# EAGLE schematic RFID_bmd200 (EAGLE 7.5.0)

## Sheet 1 of 2
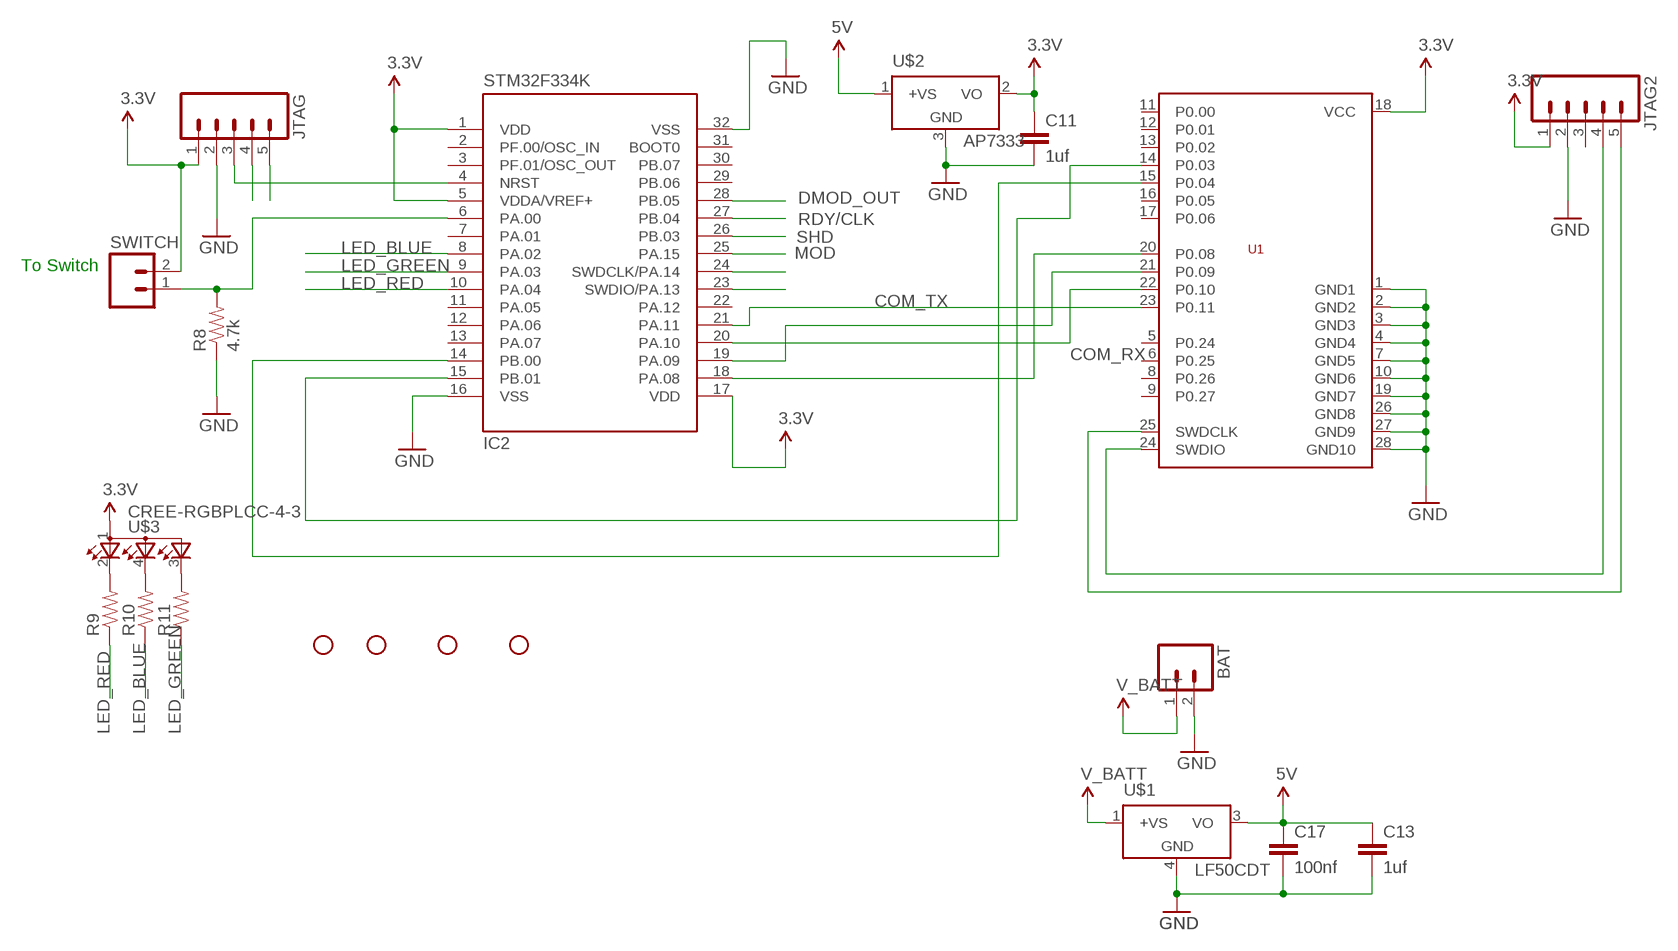
[diagram p0: schematic, sheet 1]

### Parts
BAT  M02PTH  [1X02]
C11  1uf  CAP0805  [0805]
C13  1uf  CAP0805  [0805]
C17  100nf  CAP0805  [0805]
IC2  STM32F334K  [LQFP-32]
JTAG  M05PTH  [1X05]
JTAG2  M05PTH  [1X05]
R8  4.7k  RESISTOR0805-RES  [0805]
R9  RESISTOR0805-RES  [0805]
R10  RESISTOR0805-RES  [0805]
R11  RESISTOR0805-RES  [0805]
STANDOFF1  STAND-OFF  [STAND-OFF]
STANDOFF2  STAND-OFF  [STAND-OFF]
STANDOFF3  STAND-OFF  [STAND-OFF]
STANDOFF4  STAND-OFF  [STAND-OFF]
SWITCH  M02PTH  [1X02]
U1  BMD-200  [BMD-200]
U$1  LF50CDT  [DPACK_3]
U$2  AP7333  [SOT23-3]
U$3  CREE-RGBPLCC-4-3  [P-LCC-4-3]

### Nets
3.3V: C11.1 IC2.1(VDD) IC2.5(VDDA/VREF+) IC2.17(VDD) JTAG2.1 JTAG.1 SWITCH.2 U1.18(VCC) U$2.2(VO) U$3.1(A2)
5V: C13.1 C17.1 U$1.3(VO) U$2.1(+VS) ; also sheet 2
COM_RX: IC2.20(PA.10) U1.22(P0.10)
COM_TX: IC2.19(PA.09) U1.21(P0.09)
DMOD_OUT: IC2.28(PB.05) ; also sheet 2
GND: BAT.2 C11.2 C13.2 C17.2 IC2.16(VSS) IC2.32(VSS) JTAG2.2 JTAG.2 R8.1 U1.1(GND1) U1.2(GND2) U1.3(GND3) U1.4(GND4) U1.7(GND5) U1.10(GND6) U1.19(GND7) U1.26(GND8) U1.27(GND9) U1.28(GND10) U$1.4(GND) U$2.3(GND) ; also sheet 2
LED_BLUE: IC2.8(PA.02) R10.1
LED_GREEN: IC2.9(PA.03) R11.1
LED_RED: IC2.10(PA.04) R9.1
MOD: IC2.25(PA.15) ; also sheet 2
N$3: IC2.6(PA.00) R8.2 SWITCH.1
N$4: IC2.18(PA.08) U1.20(P0.08)
N$8: IC2.21(PA.11) U1.23(P0.11)
N$16: IC2.15(PB.01) U1.14(P0.03)
N$17: JTAG2.5 U1.25(SWDCLK)
N$18: JTAG2.4 U1.24(SWDIO)
N$19: IC2.14(PB.00) U1.15(P0.04)
N$21: R9.2 U$3.2(CRED)
N$22: R10.2 U$3.4(CBLUE)
N$23: IC2.4(NRST) JTAG.3
N$26: R11.2 U$3.3(CGREEN)
RDY/CLK: IC2.27(PB.04) ; also sheet 2
SHD: IC2.26(PB.03) ; also sheet 2
STM_SWDCLK: IC2.24(SWDCLK/PA.14) JTAG.5
STM_SWDIO: IC2.23(SWDIO/PA.13) JTAG.4
V_BATT: BAT.1 U$1.1(+VS)
Unconnected: IC2.2(PF.00/OSC_IN) IC2.3(PF.01/OSC_OUT) IC2.7(PA.01) IC2.11(PA.05) IC2.12(PA.06) IC2.13(PA.07) IC2.22(PA.12) IC2.29(PB.06) IC2.30(PB.07) IC2.31(BOOT0) JTAG2.3 U1.5(P0.24) U1.6(P0.25) U1.8(P0.26) U1.9(P0.27) U1.11(P0.00) U1.12(P0.01) U1.13(P0.02) U1.16(P0.05) U1.17(P0.06)

### Notes on the sheet
- To Switch

## Sheet 2 of 2: RFid chip module
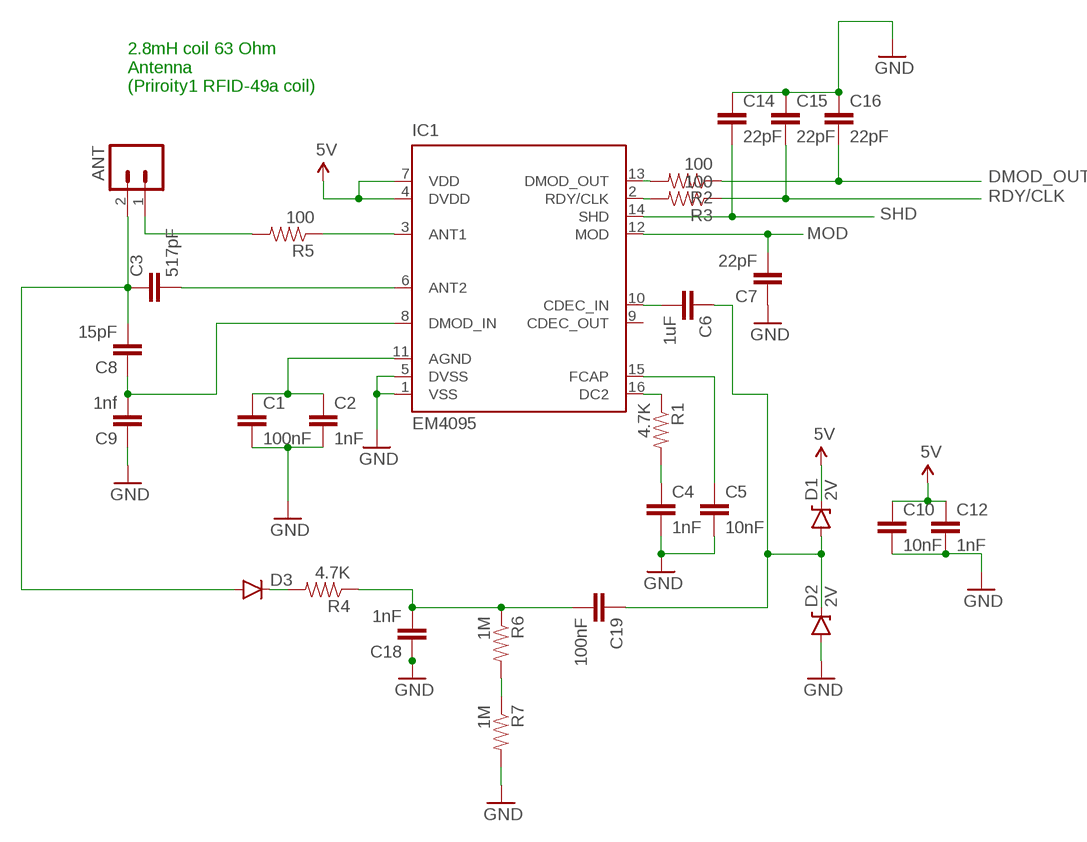
[diagram p1: schematic, sheet 2]

### Parts
ANT  M02PTH  [1X02]
C1  100nF  CAP0805  [0805]
C2  1nF  CAP0805  [0805]
C3  517pF  CAP0805  [0805]
C4  1nF  CAP0805  [0805]
C5  10nF  CAP0805  [0805]
C6  1uF  CAP0805  [0805]
C7  22pF  CAP0805  [0805]
C8  15pF  CAP0805  [0805]
C9  1nf  CAP0805  [0805]
C10  10nF  CAP0805  [0805]
C12  1nF  CAP0805  [0805]
C14  22pF  CAP0805  [0805]
C15  22pF  CAP0805  [0805]
C16  22pF  CAP0805  [0805]
C18  1nF  CAP0805  [0805]
C19  100nF  CAP  [C1812]
D1  2V  DIODE-ZENER16V  [SOD-123]
D2  2V  DIODE-ZENER16V  [SOD-123]
D3  DIODESMF  [SMF]
IC1  EM4095  [SO16]
R1  4.7K  RESISTOR0805-RES  [0805]
R2  100  RESISTOR0805-RES  [0805]
R3  100  RESISTOR0805-RES  [0805]
R4  4.7K  RESISTOR0805-RES  [0805]
R5  100  RESISTOR0805-RES  [0805]
R6  1M  RESISTOR0805-RES  [0805]
R7  1M  RESISTOR0805-RES  [0805]

### Nets
5V: C10.1 C12.1 D1.C IC1.4(DVDD) IC1.7(VDD) ; also sheet 1
ANT1: ANT.1 R5.2
DMOD_OUT: C16.2 R2.1 ; also sheet 1
GND: C1.2 C2.2 C4.2 C5.2 C7.1 C9.1 C10.2 C12.2 C14.1 C15.1 C16.1 C18.1 D2.A IC1.1(VSS) IC1.5(DVSS) R7.2 ; also sheet 1
MOD: C7.2 IC1.12(MOD) ; also sheet 1
N$1: IC1.13(DMOD_OUT) R2.2
N$2: IC1.2(RDY/CLK) R3.2
N$5: C6.2 IC1.10(CDEC_IN)
N$6: R6.2 R7.1
N$7: C5.1 IC1.15(FCAP)
N$9: C4.1 R1.2
N$10: IC1.16(DC2) R1.1
N$11: IC1.3(ANT1) R5.1
N$12: C3.2 IC1.6(ANT2)
N$13: ANT.2 C3.1 C8.2 D3.P$2(A)
N$14: C1.1 C2.1 IC1.11(AGND)
N$15: C8.1 C9.2 IC1.8(DMOD_IN)
N$24: C18.2 C19.2 R4.1 R6.1
N$25: C6.1 C19.1 D1.A D2.C
N$29: D3.P$1(C) R4.2
RDY/CLK: C15.2 R3.1 ; also sheet 1
SHD: C14.2 IC1.14(SHD) ; also sheet 1
Unconnected: IC1.9(CDEC_OUT)

### Notes on the sheet
- 2.8mH coil 63 Ohm
  Antenna
  (Priroity1 RFID-49a coil)

## Library data of the parts
ANT BAT SWITCH = SparkFun-Connectors:M02: Standard 2-pin 0.1" header. Use with - straight break away headers ( PRT-00116) - right angle break away headers (PRT-00553) - swiss pins (PRT-00743) - machine pins (PRT-00117) - female headers (PRT-00115) Molex polarized connector foot print use with: PRT-08233 with associated crimp pins and housings. 2.54_SCREWTERM for use with PRT-10571. 3.5mm Screw Terminal footprints for PRT-08084 5mm Screw Terminal footprints for use with PRT-08432
C1-C18 = SparkFun-Passives:CAP: Capacitor Standard 0603 ceramic capacitor, and 0.1" leaded capacitor.
C19 = User-Submitted:CAP
D1 D2 = SparkFun-DiscreteSemi:DIODE-ZENER: Zener Diode Production Part - 8199 3.4V Zener Voltage; PROD_ID: DIO-12440; VALUE: 16V
D3 = SparkFun-DiscreteSemi:DIODE: Diode These are standard reverse protection diodes and small signal diodes. SMA package can handle up to about 1A. SOD-323 can handle about 200mA. What the SOD-323 package when ordering, there are some mfgs out there that are 5-pin packages.
IC1 = em-microelectronic:EM4095: Read/Write analog front end for 125kHz RFID Basestation Source: http://www.emmicroelectronic.com/webfiles/Product/RFID/DS/EM4095_DS.pdf
IC2 = User-Submitted:STM32F334K: ST micro STM32F334K is a 72Mhz ARM Cortex-M4 with FPU
JTAG JTAG2 = SparkFun-Connectors:M05: Header 5 Standard 5-pin 0.1" header. Use with straight break away headers (SKU : PRT-00116), right angle break away headers (PRT-00553), swiss pins (PRT-00743), machine pins (PRT-00117), and female headers (PRT-00115). Molex polarized connector foot print use with SKU : PRT-08230 with associated crimp pins and housings.
R1-R11 = SparkFun-Passives:RESISTOR: Resistor Basic schematic elements and footprints for 0603, 1206, and PTH resistors.
STANDOFF1-STANDOFF4 = SparkFun-Electromechanical:STAND-OFF: #4 Stand Off This is the mechanical footprint for a #4 phillips button head screw. Use the keepout ring to avoid running the screw head into surrounding components. SKU : PRT-00447
U1 = BMD-200:BMD-200
U$1 = User-Submitted:LF50CDT
U$2 = User-Submitted:AP7333
U$3 = User-Submitted:CREE-RGB